# Altium schematic sheet powerA.SchDoc
size A4
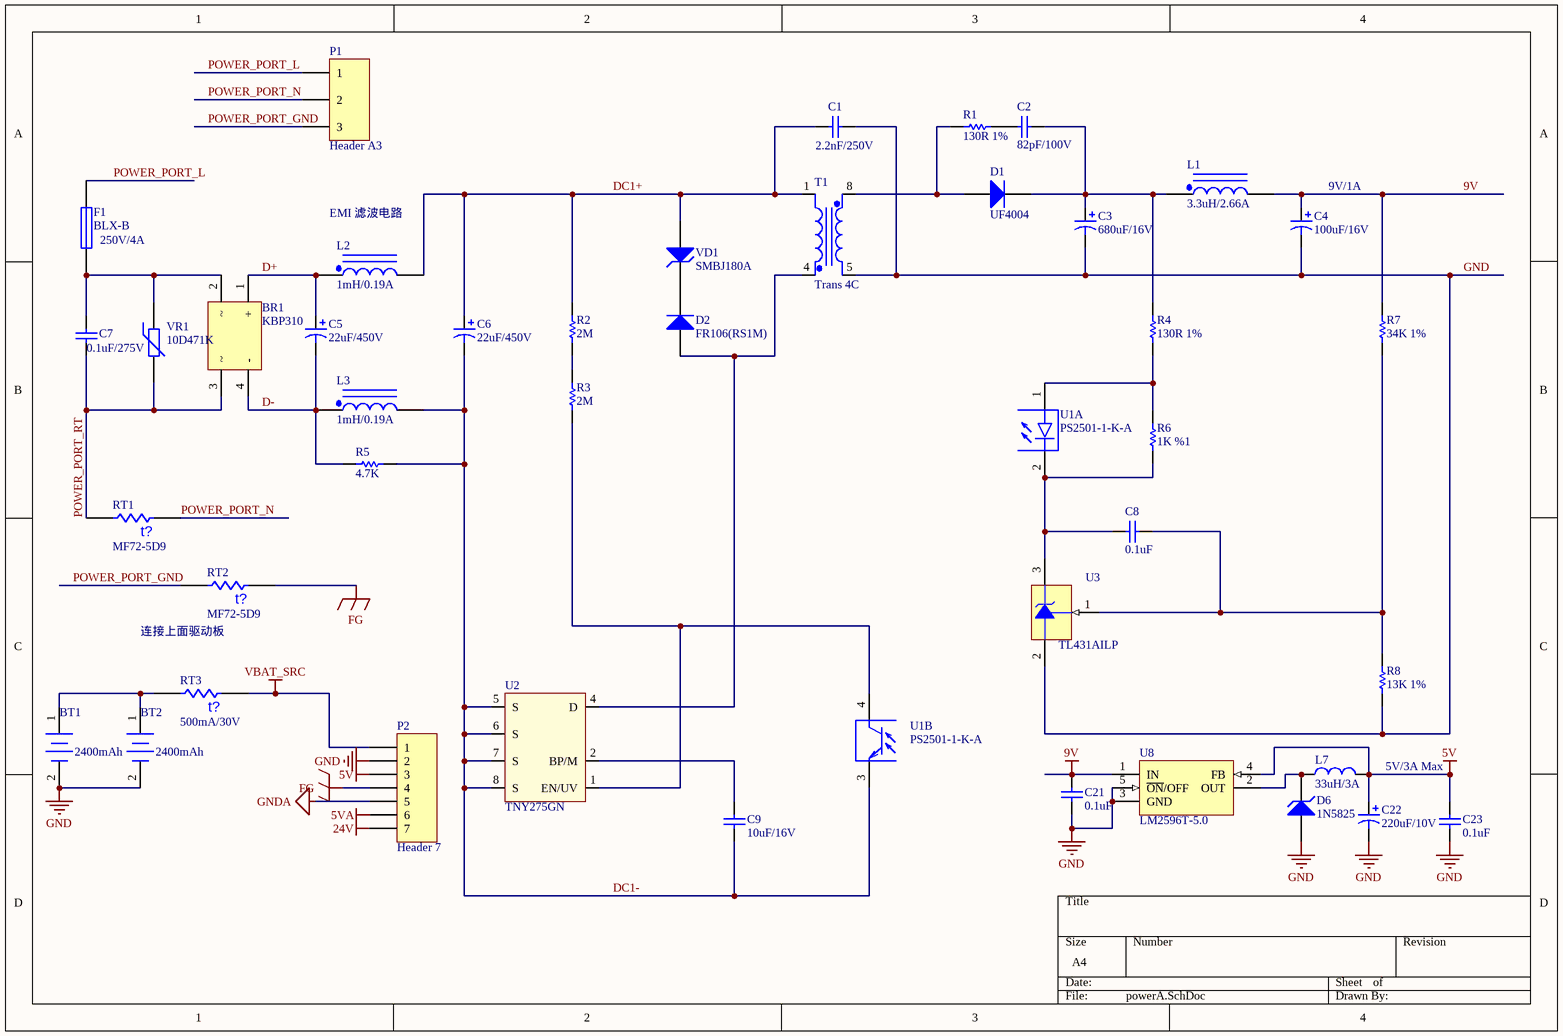
[diagram p0: powerA.SchDoc]

## Parts
BR1  KBP310  [BRD1]
BT1  2400mAh  [BAT-14500]
BT2  2400mAh  [BAT-14500]
C1  2.2nF/250V  [CAPRD5-9x3B]
C2  82pF/100V  [CAPC3216M]
C3  680uF/16V  [CAPPR2.5-8x12]
C4  100uF/16V  [CAPPR2-5x7]
C5  22uF/450V  [CAPPR7.5-16x25B]
C6  22uF/450V  [CAPPR7.5-16x25B]
C7  0.1uF/275V  [CAPRD10-12x6]
C8  0.1uF  [CAPC3216M]
C9  10uF/16V  [CAPC3216M]
C21  0.1uF  [CAPC3216M]
C22  220uF/10V  [CAPPR2.5-6.3x11.5]
C23  0.1uF  [CAPC3216M]
D1  UF4004  [SMA]
D2  FR106(RS1M)  [SMA]
D6  1N5825  [SMB]
F1  BLX-B  [FUSE22]
L1  3.3uH/2.66A  [L0810]
L2  1mH/0.19A  [L0810]
L3  1mH/0.19A  [L0810]
L7  33uH/3A  [L0810]
P1  Header A3  [DG500HH-5.08-3]
P2  Header 7  [HDR1X7]
R1  130R 1%  [RESC3216M]
R2  2M  [RESC3216M]
R3  2M  [RESC3216M]
R4  130R 1%  [RESC3216M]
R5  4.7K  [RESC3216M]
R6  1K %1  [RESC3216M]
R7  34K 1%  [RESC3216M]
R8  13K 1%  [RESC3216M]
RT1  MF72-5D9  [CAPRD7.5-11x4A]
RT2  MF72-5D9  [CAPRD7.5-11x4A]
RT3  500mA/30V  [RESC3216M]
T1  Trans 4C  [EE19W(2+2)]
U1  PS2501-1-K-A  [SOP-4]  (parts A,B of 2)
U2  TNY275GN  [SMD-8C]
U3  TL431AILP  [TO-92AA]
U8  LM2596T-5.0  [TO-220-5]
VD1  SMBJ180A  [SMB]
VR1  10D471K  [CAPRD7.5-7x4C]

## Nets
5V: C22.1 C23.2 L7.2 P2.3 U8.4(FB)
5VA: P2.6
9V: C4.1 C21.1 L1.2 R7.2 U8.1(IN)
24V: P2.7
FG: P2.4 RT2.1
GND: BT1.2(-) BT2.2(-) C1.2 C3.2 C4.2 C21.2 C22.2 C23.1 D6.1(A) P2.2 R8.1 T1.5(Sec-) U3.2(A) U8.3(GND) U8.5(~{ON}/OFF)
GNDA: P2.5
VBAT_SRC: P2.1 RT3.1
D+: BR1.1(+) C5.1 L2.1
D-: BR1.4(-) C5.2 L3.1 R5.2
DC1+: C1.1 C6.1 L2.2 R2.2 T1.1(Pri+) VD1.1(A)
DC1-: C6.2 C9.2 L3.2 R5.1 U1.3(E) U2.5(S) U2.6(S) U2.7(S) U2.8(S)
POWER_PORT_GND: P1.3 RT2.2
POWER_PORT_L: F1.1 P1.1
POWER_PORT_N: P1.2 RT1.1
POWER_PORT_RT: BR1.3 C7.1 RT1.2 VR1.2
NetBR1_2: BR1.2 C7.2 F1.2 VR1.1
NetBT1_1: BT1.1(+) BT2.1(+) RT3.2
NetC2_1: C2.1 C3.1 D1.2(K) L1.1 R4.2
NetC2_2: C2.2 R1.1
NetC8_1: C8.1 R7.1 R8.2 U3.1(REF)
NetC8_2: C8.2 R6.1 U1.2(-) U3.3(K)
NetC9_1: C9.1 U2.2(BP/M)
NetD1_1: D1.1(A) R1.2 T1.8(Sec+)
NetD2_1: D2.1(A) T1.4(Pri-) U2.4(D)
NetD2_2: D2.2(K) VD1.2(K)
NetD6_2: D6.2(K) L7.1 U8.2(OUT)
NetR2_1: R2.1 R3.1
NetR3_2: R3.2 U1.4(C) U2.1(EN/UV)
NetR4_1: R4.1 R6.2 U1.1(+)

## Notes on the sheet
- (near F1) 250V/4A
- EMI 滤波电路
- (near C4) 9V/1A
- 连接上面驱动板
- 5V/3A Max
- (in symbol Res Thermal) t?

## Library data of the parts
BR1 = KP210: AC-DC Bridge
BT1 BT2 = Battery: Battery holder; Published: 24-Mar-1999; LatestRevisionDate: 17-Jul-2002; LatestRevisionNote: Re-released for DXP Platform.; PackageReference: BAT-2; Publisher: Altium Limited
C1 C2 C7-C9 = Cap: Capacitor; Value: 100pF; Published: 8-Jun-2000; LatestRevisionDate: 17-Jul-2002; LatestRevisionNote: Re-released for DXP Platform.; PackageReference: RAD-0.3; Publisher: Altium Limited
C3-C6 C22 = Cap Pol1: Polarized Capacitor (Radial); Value: 100pF; Published: 8-Jun-2000; LatestRevisionDate: 17-Jul-2002; LatestRevisionNote: Re-released for DXP Platform.; PackageReference: RB7.6-15; Publisher: Altium Limited
C21 C23 = Cap: Capacitor; Value: 1nF; Published: 8-Jun-2000; LatestRevisionDate: 17-Jul-2002; LatestRevisionNote: Re-released for DXP Platform.; PackageReference: RAD-0.3; Publisher: Altium Limited
D1 D2 = Diode 1N4148: High Conductance Fast Diode; Published: 8-Jun-2000; LatestRevisionDate: 17-Jul-2002; LatestRevisionNote: Re-released for DXP Platform.; DatasheetVersion: 1997; PackageReference: DO-35; Publisher: Altium Limited; Code_JEDEC: DO-204-AH; ComponentLink1Description: Manufacturer Link; ComponentLink1URL: http://www.fairchildsemi.com/; ComponentLink2Description: Datasheet; ComponentLink2URL: http://www.fairchildsemi.com/ds/1N%2F1N4148.pdf
D6 VD1 = D Zener: Zener Diode; Published: 8-Jun-2000; LatestRevisionDate: 17-Jul-2002; LatestRevisionNote: Re-released for DXP Platform.; PackageReference: DIODE-0.7; Publisher: Altium Limited; PackageDescription: Diode, Thru-Hole; 2 Leads; 0.7 in Pin Spacing
F1 = Fuse 1: Fuse Holder 25mm(L)x10mm(W)x13mm(H); Published: 8-Jun-2000; LatestRevisionDate: 17-Jul-2002; LatestRevisionNote: Re-released for DXP Platform.; PackageReference: PIN-W2/E2.8; Publisher: Altium Limited
L1-L3 = Inductor Iron Dot: Magnetic-Core Inductor with Winding Polarity Marking; Value: 10mH; Published: 24-Mar-1999; LatestRevisionDate: 17-Jul-2002; LatestRevisionNote: Re-released for DXP Platform.; PackageReference: DIODE_SMC; Publisher: Altium Limited; PackageDescription: Diode; 2 Leads
L7 = Inductor: Inductor with Winding No Polarity Marking; Published: 24-Mar-1999; LatestRevisionDate: 17-Jul-2002; LatestRevisionNote: Re-released for DXP Platform.; PackageReference: DIODE_SMC; Publisher: Altium Limited
P1 = Header A3: Header, 3-Pin; LatestRevisionDate: 17-Jul-2002; LatestRevisionNote: Re-released for DXP Platform.; Publisher: Altium Limited
P2 = Header 7: Header, 7-Pin; LatestRevisionDate: 17-Jul-2002; LatestRevisionNote: Re-released for DXP Platform.; Publisher: Altium Limited
R1-R5 R7 R8 = Res Semi: Metal film Resistor; Value: 1K; Published: 8-Jun-2000; LatestRevisionDate: 17-Jul-2002; LatestRevisionNote: Re-released for DXP Platform.; PackageReference: AXIAL-0.5; Publisher: Altium Limited
R6 = Res Semi: Metal film Resistor; Published: 8-Jun-2000; LatestRevisionDate: 17-Jul-2002; LatestRevisionNote: Re-released for DXP Platform.; PackageReference: AXIAL-0.5; Publisher: Altium Limited; Value: 1K
RT1-RT3 = Res Thermal: Thermistor; Published: 24-Mar-1999; LatestRevisionDate: 29-May-2009; LatestRevisionNote: IPC-7351 Footprint Added.; PackageVersion: Mar-2003; PackageReference: 6-0805; Publisher: Altium Limited; PackageDescription: Chip Resistor 0805 Case Size; Code_IPC: RESC2012
T1 = Trans 4C: Transformer; Published: 8-Jun-2000; LatestRevisionDate: 17-Jul-2002; LatestRevisionNote: Re-released for DXP Platform.; PackageReference: TRF_4; Publisher: Altium Limited
U1 = PC817D: Single-Supply Dual Operational Amplifier,10MHz; Published: 28-Feb-2003; LatestRevisionDate: 13-Apr-2006; LatestRevisionNote: IPC-7351 Footprint Added.; DatasheetVersion: Jan-2002, Rev. 7; PackageVersion: rev7, Jan-2002; PackageReference: 751-07; Publisher: Altium Limited; PackageDescription: 8-Pin Plastic Small Outline Integrated Circuit 1.27 mm Pitch; Code_JEDEC: MS-012-AA; Code_IPC: SOIC127P600-8; ComponentLink1Description: Manufacturer Link; ComponentLink1URL: http://www.onsemi.com/; ComponentLink2Description: Datasheet; ComponentLink2URL: http://www.onsemi.com/pub/Collateral/LM358-D.PDF
U2 = TNY279PN
U3 = TL431CLP: Programmable Precision Reference; Published: 15-Apr-2002; DatasheetVersion: 1999; PackageVersion: 1996; PackageReference: 29-04; Publisher: Altium Limited; PackageDescription: TO, Flat Index; 3 In-Line, Axial Leads; Body Dia. 4.8mm; Leads 0.48 x 0.51 mm (max); ComponentLink1Description: Manufacturer Link; ComponentLink1URL: http://www.onsemi.com/site/products/taxonomy/0,4438,503,00.html; ComponentLink2Description: Datasheet; ComponentLink2URL: http://www.onsemi.com/pub/Collateral/TL431-D.PDF
U8 = LM2596T-5.0: 5V稳压芯片; Note: Tab is connected to GND; Published: 15-Apr-2002; DatasheetVersion: Dec-1997; PackageReference: TS5B; Publisher: Altium Limited; PackageDescription: D2-PAK; 5 Leads; Body 14.4 (inc. leads) x 10.4 mm (LxW max); ComponentLink1Description: Manufacturer Link; ComponentLink1URL: http://www.national.com/; ComponentLink2Description: Datasheet; ComponentLink2URL: http://www.national.com/ds.cgi/LM/LM2596.pdf; ComponentLink3Description: URL Link1; ComponentLink3URL: http://www.national.com/pf/LM/LM2596.html
VR1 = Res Varistor: Varistor (Voltage-Sensitive Resistor); Published: 24-Mar-1999; LatestRevisionDate: 29-May-2009; LatestRevisionNote: IPC-7351 Footprint Added.; PackageVersion: Mar-2003; PackageReference: 6-0805; Publisher: Altium Limited; PackageDescription: Chip Resistor 0805 Case Size; Code_IPC: RESC2012